# Altium schematic sheet PCB.SchDoc
size A4
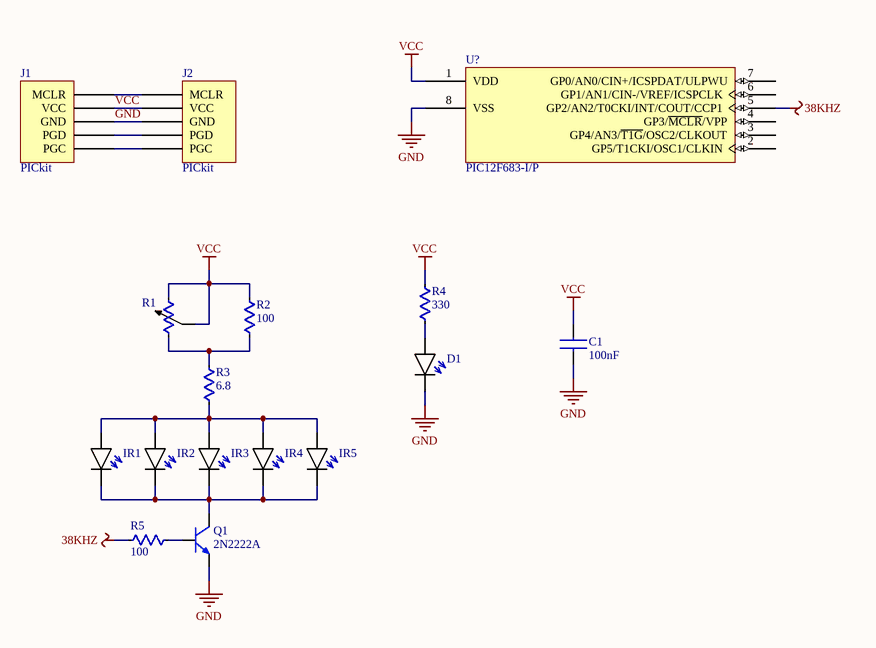
[diagram p0: PCB.SchDoc]

## Parts
C1  value 100nF  [CAP-CER]  (hidden comment: CAP-CER)
D1  LED  [LED-3MM-RED]  (value not drawn)
IR1  LED  [LED-5MM-CLEAR]  (value not drawn)
IR2  LED  [LED-5MM-CLEAR]  (value not drawn)
IR3  LED  [LED-5MM-CLEAR]  (value not drawn)
IR4  LED  [LED-5MM-CLEAR]  (value not drawn)
IR5  LED  [LED-5MM-CLEAR]  (value not drawn)
J1  PICkit  [Header 1x5]
J2  PICkit  [Header 1x5]
Q1  2N2222A  [TO-92]
R1  POT  [TRIMPOT]  (value not drawn)
R2  value 100  [RES-Axial-400mil]  (hidden comment: RES)
R3  value 6.8  [RES-Axial-400mil]  (hidden comment: RES)
R4  value 330  [RES-Axial-400mil]  (hidden comment: RES)
R5  value 100  [RES-Axial-400mil]  (hidden comment: RES)
U?  PIC12F683-I/P  [PDIP300-P8]

## Nets
38KHZ: R5.1 U?.5(GP2/AN2/T0CKI/INT/COUT/CCP1)
GND: C1.1 D1.K J1.3(GND) J2.3(GND) Q1.E U?.8(VSS)
VCC: C1.2 J1.2(VCC) J2.2(VCC) R1.1 R1.2 R2.2 R4.2 U?.1(VDD)
NetD1_A: D1.A R4.1
NetIR1_A: IR1.A IR2.A IR3.A IR4.A IR5.A R3.1
NetIR1_K: IR1.K IR2.K IR3.K IR4.K IR5.K Q1.C
NetJ1_1: J1.1(MCLR) J2.1(MCLR)
NetJ1_4: J1.4(PGD) J2.4(PGD)
NetJ1_5: J1.5(PGC) J2.5(PGC)
NetQ1_B: Q1.B R5.2
NetR1_3: R1.3 R2.1 R3.2

Not connected (* = marked no-connect by the designer): U? 2(GP5/T1CKI/OSC1/CLKIN) 3(GP4/AN3/~{T1G}/OSC2/CLKOUT) 4(GP3/~{MCLR}/VPP) 6(GP1/AN1/CIN-/VREF/ICSPCLK) 7(GP0/AN0/CIN+/ICSPDAT/ULPWU)

## Library data of the parts
Q1 = NPN
U? = PIC12F683-I/P: Flash-Based 8-Bit CMOS Microcontroller with nanoWatt Technology, 2K (x14-Bit words) Program Memory, 384 Bytes Data Memory, 8-Pin PDIP, Industrial Temperature; Published: 29-Jan-2009; LatestRevisionDate: 02-Dec-2009; LatestRevisionNote: Updated to datasheet revision revD, Feb-2007.; DatasheetVersion: revD, Feb-2007; PackageVersion: revBB, Aug-2009; PackageReference: PDIP300-P8; Publisher: Altium Limited; PackageDescription: 8-Lead Plastic Dual In-Line (P) - 300 mil Body [PDIP]; Supplier 1: Digi-Key; Supplier Part Number 1: PIC12F683-I/P-ND; Supplier 2: Farnell; Supplier Part Number 2: 9759034; Supplier 3: Farnell; Supplier Part Number 3: 1523923; Code_JEDEC: MS-001; ComponentLink1Description: Datasheet; ComponentLink1URL: http://ww1.microchip.com/downloads/en/DeviceDoc/41211D_.pdf; ComponentLink2Description: Packaging Specification; ComponentLink2URL: http://www.microchip.com/stellent/groups/techpub_sg/documents/packagingspec/en012702.pdf; ComponentLink3Description: Microchip.com Home; ComponentLink3URL: http://www.microchip.com/